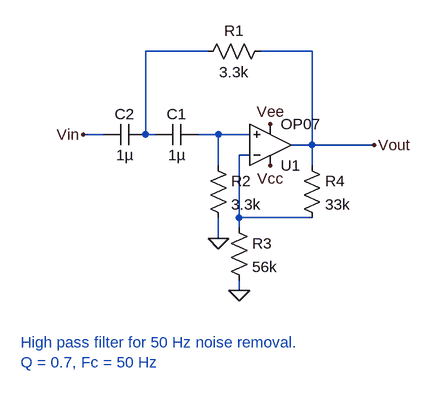
[diagram p0: schematic HighPass.asc]
HighPass.asc, the LTspice schematic file:
Version 4
SHEET 1 880 680
WIRE 32 48 -64 48
WIRE 192 48 112 48
WIRE -128 176 -160 176
WIRE -64 176 -64 48
WIRE -48 176 -64 176
WIRE 48 176 16 176
WIRE 96 176 48 176
WIRE 192 192 192 48
WIRE 192 192 160 192
WIRE 288 192 192 192
WIRE 96 208 80 208
WIRE 48 224 48 176
WIRE 192 224 192 192
WIRE 80 304 80 208
WIRE 192 304 80 304
WIRE 80 320 80 304
WIRE 48 336 48 304
WIRE 80 416 80 400
FLAG -160 176 Vin
FLAG 80 416 0
FLAG 48 336 0
FLAG 128 224 Vcc
FLAG 128 160 Vee
FLAG 288 192 Vout
SYMBOL Opamps\\OP07 128 256 M180
SYMATTR InstName U1
SYMBOL cap 16 160 R90
WINDOW 0 0 32 VBottom 2
WINDOW 3 32 32 VTop 2
SYMATTR InstName C1
SYMATTR Value 1µ
SYMBOL cap -64 160 R90
WINDOW 0 0 32 VBottom 2
WINDOW 3 32 32 VTop 2
SYMATTR InstName C2
SYMATTR Value 1µ
SYMBOL res 128 32 R90
WINDOW 0 0 56 VBottom 2
WINDOW 3 32 56 VTop 2
SYMATTR InstName R1
SYMATTR Value 3.3k
SYMBOL res 32 208 R0
SYMATTR InstName R2
SYMATTR Value 3.3k
SYMBOL res 64 304 R0
SYMATTR InstName R3
SYMATTR Value 56k
SYMBOL res 176 208 R0
SYMATTR InstName R4
SYMATTR Value 33k
TEXT -256 496 Left 2 ;High pass filter for 50 Hz noise removal.\nQ = 0.7, Fc = 50 Hz

The netlist it stands for:
* HighPass.asc
XU1 N002 N003 Vcc Vee Vout LT1001  ; OP07, pins In+ In- V+ V- OUT
C1 N002 N001 1µ
C2 N001 Vin 1µ
R1 Vout N001 3.3k
R2 N002 0 3.3k
R3 N003 0 56k
R4 Vout N003 33k
* High pass filter for 50 Hz noise removal.
* Q = 0.7, Fc = 50 Hz
.lib LTC.lib
.backanno
.end